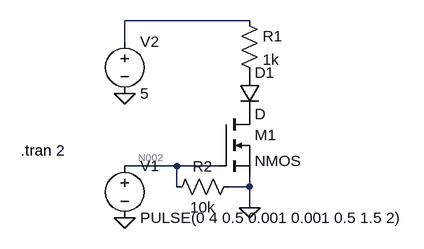
[diagram p0: schematic swich.asc]
swich.asc, the LTspice schematic file:
Version 4.1
SHEET 1 880 680
WIRE 256 -48 64 -48
WIRE 64 -16 64 -48
WIRE 144 176 64 176
WIRE 208 176 144 176
WIRE 144 208 144 176
WIRE 256 208 256 192
WIRE 256 208 224 208
WIRE 256 240 256 208
FLAG 64 64 0
FLAG 64 256 0
FLAG 256 240 0
SYMBOL voltage 64 160 R0
WINDOW 123 0 0 Left 0
WINDOW 39 0 0 Left 0
SYMATTR InstName V1
SYMATTR Value PULSE(0 4 0.5 0.001 0.001 0.5 1.5 2)
SYMBOL voltage 64 -32 R0
WINDOW 123 0 0 Left 0
WINDOW 39 0 0 Left 0
SYMATTR InstName V2
SYMATTR Value 5
SYMBOL nmos 208 96 R0
SYMATTR InstName M1
SYMBOL diode 240 32 R0
SYMATTR InstName D1
SYMBOL res 240 -64 R0
SYMATTR InstName R1
SYMATTR Value 1k
SYMBOL res 240 192 R90
WINDOW 0 0 56 VBottom 2
WINDOW 3 32 56 VTop 2
SYMATTR InstName R2
SYMATTR Value 10k
TEXT -96 152 Left 2 !.tran 2

The netlist it stands for:
* swich.asc
V1 N002 0 PULSE(0 4 0.5 0.001 0.001 0.5 1.5 2)
V2 N001 0 5
M1 P001 N002 0 0 NMOS
D1 P002 P001 D
R1 N001 P002 1k
R2 0 N002 10k
.model D D
.lib standard.dio
.model NMOS NMOS
.model PMOS PMOS
.lib standard.mos
.tran 2
.backanno
.end

* Results of the author's LTspice run, read from the files saved beside the schematic
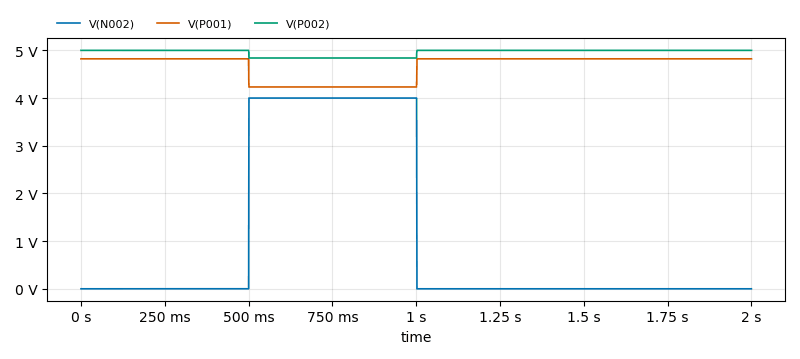
[diagram p1: Transient Analysis of swich.asc, plotted from the saved traces]
* Transient Analysis, 1 run:
*   V(N002): min 0 V, max 4 V, average 1.002 V, rms 2.001 V, last 0 V
*   V(P001): min 4.232 V, max 4.823 V, average 4.675 V, rms 4.682 V, last 4.823 V
*   V(P002): min 4.84 V, max 5 V, average 4.96 V, rms 4.96 V, last 5 V